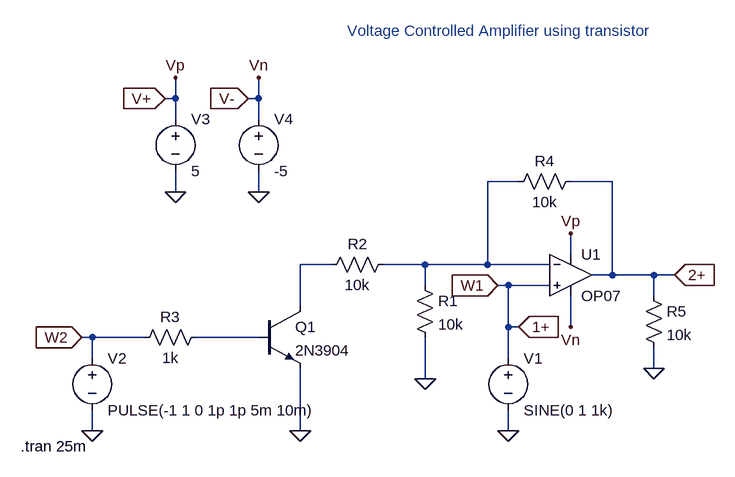
[diagram p0: schematic vctrl_amp_transistor.asc]
vctrl_amp_transistor.asc, the LTspice schematic file:
Version 4
SHEET 1 880 680
WIRE -384 -128 -384 -160
WIRE -384 -128 -400 -128
WIRE -256 -128 -256 -160
WIRE -256 -128 -272 -128
WIRE -384 -96 -384 -128
WIRE -256 -96 -256 -128
WIRE 144 0 96 0
WIRE 288 0 224 0
WIRE -384 16 -384 -16
WIRE -256 16 -256 -16
WIRE 224 112 224 80
WIRE -144 128 -192 128
WIRE 0 128 -64 128
WIRE 96 128 96 0
WIRE 96 128 0 128
WIRE 192 128 96 128
WIRE 288 144 288 0
WIRE 288 144 256 144
WIRE 352 144 288 144
WIRE 384 144 352 144
WIRE 0 160 0 128
WIRE 128 160 112 160
WIRE 192 160 128 160
WIRE 352 176 352 144
WIRE -192 192 -192 128
WIRE 128 224 128 160
WIRE 144 224 128 224
WIRE 224 224 224 176
WIRE -512 240 -528 240
WIRE -432 240 -512 240
WIRE -256 240 -352 240
WIRE -512 272 -512 240
WIRE 128 272 128 224
WIRE 352 288 352 256
WIRE 0 304 0 240
WIRE -512 384 -512 352
WIRE -192 384 -192 288
WIRE 128 384 128 352
FLAG 128 384 0
FLAG 0 304 0
FLAG -192 384 0
FLAG -512 384 0
FLAG 352 288 0
FLAG 224 80 Vp
FLAG 224 224 Vn
FLAG -384 16 0
FLAG -256 16 0
FLAG -384 -160 Vp
FLAG -256 -160 Vn
FLAG -400 -128 V+
IOPIN -400 -128 In
FLAG -272 -128 V-
IOPIN -272 -128 In
FLAG -528 240 W2
IOPIN -528 240 In
FLAG 112 160 W1
IOPIN 112 160 In
FLAG 144 224 1+
IOPIN 144 224 In
FLAG 384 144 2+
IOPIN 384 144 In
SYMBOL voltage 128 256 R0
WINDOW 123 0 0 Left 0
WINDOW 39 0 0 Left 0
SYMATTR InstName V1
SYMATTR Value SINE(0 1 1k)
SYMBOL res -16 144 R0
SYMATTR InstName R1
SYMATTR Value 10k
SYMBOL res -48 112 R90
WINDOW 0 0 56 VBottom 2
WINDOW 3 32 56 VTop 2
SYMATTR InstName R2
SYMATTR Value 10k
SYMBOL npn -256 192 R0
SYMATTR InstName Q1
SYMATTR Value 2N3904
SYMBOL res -336 224 R90
WINDOW 0 0 56 VBottom 2
WINDOW 3 32 56 VTop 2
SYMATTR InstName R3
SYMATTR Value 1k
SYMBOL voltage -512 256 R0
WINDOW 123 0 0 Left 0
WINDOW 39 0 0 Left 0
SYMATTR InstName V2
SYMATTR Value PULSE(-1 1 0 1p 1p 5m 10m)
SYMBOL res 240 -16 R90
WINDOW 0 0 56 VBottom 2
WINDOW 3 32 56 VTop 2
SYMATTR InstName R4
SYMATTR Value 10k
SYMBOL res 336 160 R0
SYMATTR InstName R5
SYMATTR Value 10k
SYMBOL voltage -384 -112 R0
WINDOW 123 0 0 Left 0
WINDOW 39 0 0 Left 0
SYMATTR InstName V3
SYMATTR Value 5
SYMBOL voltage -256 -112 R0
WINDOW 123 0 0 Left 0
WINDOW 39 0 0 Left 0
SYMATTR InstName V4
SYMATTR Value -5
SYMBOL Opamps\\OP07 224 80 R0
SYMATTR InstName U1
TEXT -622 408 Left 2 !.tran 25m
TEXT -120 -232 Left 2 ;Voltage Controlled Amplifier using transistor

The netlist it stands for:
* vctrl_amp_transistor.asc
V1 1+ 0 SINE(0 1 1k)
R1 N001 0 10k
R2 N001 N002 10k
Q1 N002 N003 0 0 2N3904
R3 N003 W2 1k
V2 W2 0 PULSE(-1 1 0 1p 1p 5m 10m)
R4 2+ N001 10k
R5 2+ 0 10k
V3 V+ 0 5
V4 V- 0 -5
XU1 1+ N001 V+ V- 2+ LT1001  ; OP07, pins In+ In- V+ V- OUT
.model NPN NPN
.model PNP PNP
.lib standard.bjt
.tran 25m
* Voltage Controlled Amplifier using transistor
.lib LTC.lib
.backanno
.end